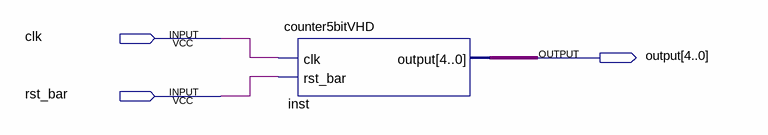
[diagram p0: schematic sheet]
// Quartus schematic 5bitCounter.bdf as structural Verilog: 1 symbols, 3 pins
module \5bitCounter  (
  input  clk,
  input  rst_bar,
  output [4:0] \output 
);

  counter5bitVHD inst (.clk(clk), .rst_bar(rst_bar), .\output (\output ));
endmodule
